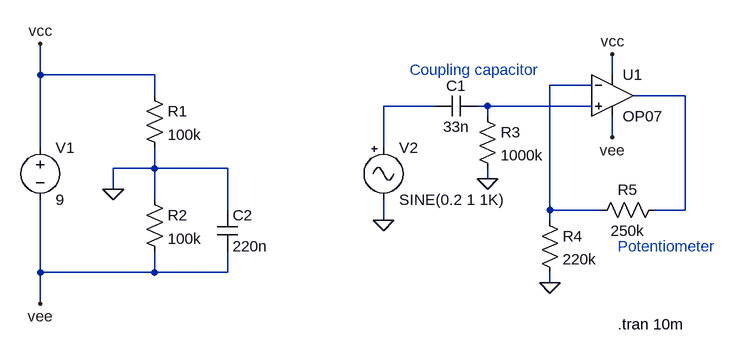
[diagram p0: schematic boost-pedal.asc]
boost-pedal.asc, the LTspice schematic file:
Version 4
SHEET 1 936 680
WIRE -368 112 -368 64
WIRE -192 112 -368 112
WIRE 512 112 512 80
WIRE 480 128 416 128
WIRE -192 144 -192 112
WIRE 624 144 544 144
WIRE 240 160 160 160
WIRE 320 160 304 160
WIRE 480 160 320 160
WIRE 320 176 320 160
WIRE 512 208 512 176
WIRE -368 224 -368 112
WIRE 160 224 160 160
WIRE -192 256 -192 224
WIRE -192 256 -256 256
WIRE -80 256 -192 256
WIRE 320 272 320 256
WIRE -256 288 -256 256
WIRE -192 304 -192 256
WIRE -80 320 -80 256
WIRE 416 320 416 128
WIRE 496 320 416 320
WIRE 624 320 624 144
WIRE 624 320 576 320
WIRE 160 336 160 304
WIRE 416 336 416 320
WIRE -368 416 -368 304
WIRE -192 416 -192 384
WIRE -192 416 -368 416
WIRE -80 416 -80 384
WIRE -80 416 -192 416
WIRE 416 432 416 416
WIRE -368 464 -368 416
FLAG -256 288 0
FLAG -368 64 vcc
FLAG -368 464 vee
FLAG 512 80 vcc
FLAG 512 208 vee
FLAG 416 432 0
FLAG 160 336 0
FLAG 320 272 0
SYMBOL OpAmps/OP07 512 80 R0
SYMATTR InstName U1
SYMBOL voltage -368 208 R0
SYMATTR InstName V1
SYMATTR Value 9
SYMBOL res -208 128 R0
SYMATTR InstName R1
SYMATTR Value 100k
SYMBOL res -208 288 R0
SYMATTR InstName R2
SYMATTR Value 100k
SYMBOL res 400 320 R0
SYMATTR InstName R4
SYMATTR Value 220k
SYMBOL res 592 304 R90
WINDOW 0 0 56 VBottom 2
WINDOW 3 32 56 VTop 2
SYMATTR InstName R5
SYMATTR Value 250k
SYMBOL Misc/signal 160 208 R0
SYMATTR InstName V2
SYMATTR Value SINE(0.2 1 1K)
SYMBOL cap 304 144 R90
WINDOW 0 0 32 VBottom 2
WINDOW 3 32 32 VTop 2
SYMATTR InstName C1
SYMATTR Value 33n
SYMBOL res 304 160 R0
SYMATTR InstName R3
SYMATTR Value 1000k
SYMBOL cap -96 320 R0
SYMATTR InstName C2
SYMATTR Value 220n
TEXT 520 496 Left 2 !.tran 10m
TEXT 520 376 Left 2 ;Potentiometer
TEXT 200 104 Left 2 ;Coupling capacitor

The netlist it stands for:
* boost-pedal.asc
XU1 N004 N001 vcc vee N002 LT1001  ; OP07, pins In+ In- V+ V- OUT
V1 vcc vee 9
R1 vcc 0 100k
R2 0 vee 100k
R4 N001 0 220k
R5 N002 N001 250k
V2 N003 0 SINE(0.2 1 1K)
C1 N004 N003 33n
R3 N004 0 1000k
C2 0 vee 220n
.tran 10m
* Potentiometer
* Coupling capacitor
.lib LTC.lib
.backanno
.end